# EAGLE design Transient tester (DC supply) r2B1 (EAGLE 6.1)
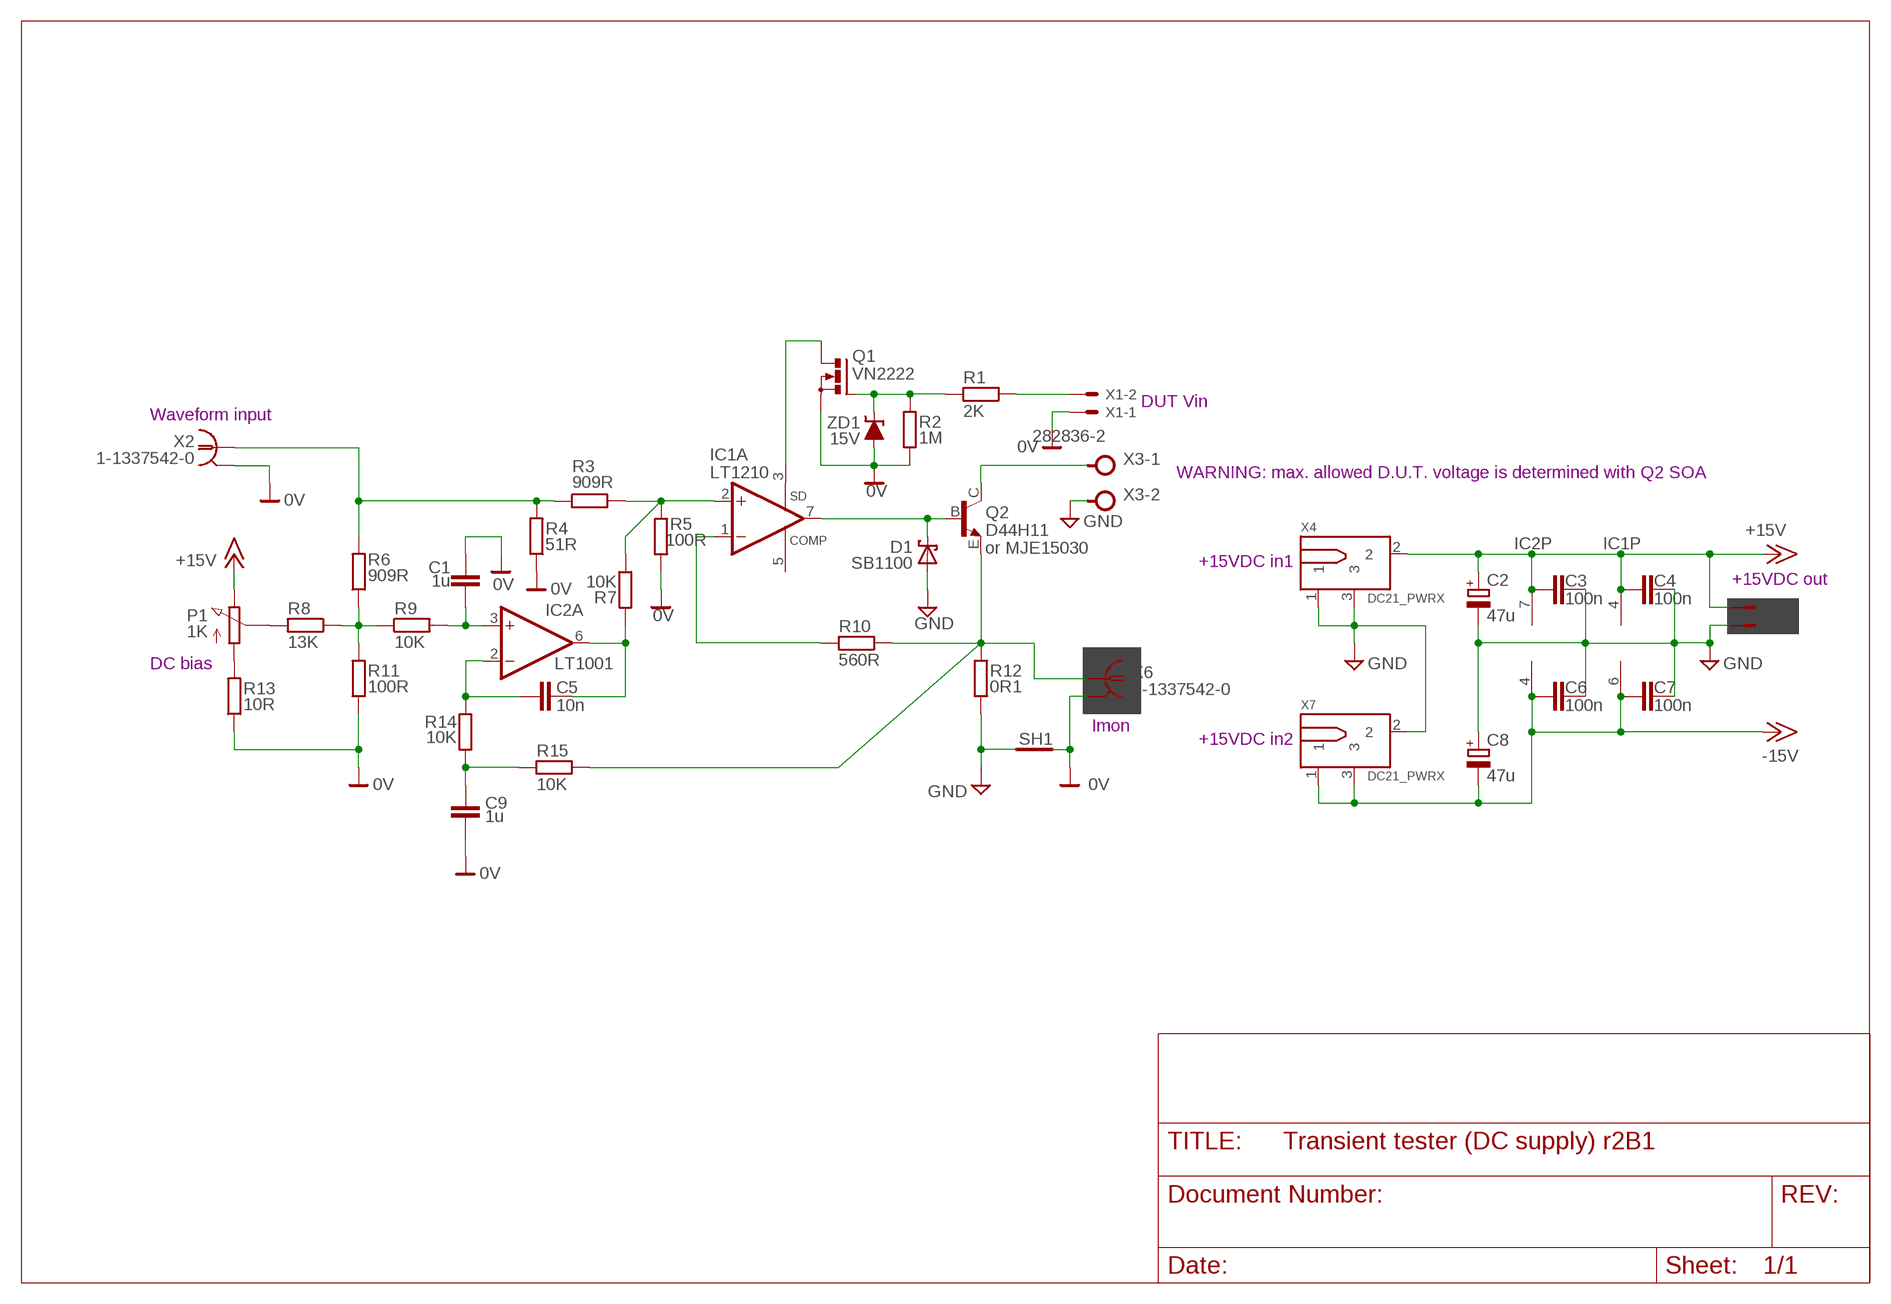
[diagram p0: schematic, sheet 1]

## Parts
C1  1u  C-EU050-075X075  [C050-075X075]
C2  47u  ECAP2.5G_7MM  [ECAP2.5/7]
C3  100n  C-EU050-025X075  [C050-025X075]
C4  100n  C-EU050-025X075  [C050-025X075]
C5  10n  C-EU050-025X075  [C050-025X075]
C6  100n  C-EU050-025X075  [C050-025X075]
C7  100n  C-EU050-025X075  [C050-025X075]
C8  47u  ECAP2.5G_7MM  [ECAP2.5/7]
C9  1u  C-EU050-075X075  [C050-075X075]
D1  SB1100  SCHOTTKY  [DO34/10]
IC1  LT1210  [TO220-7]
IC2  LT1001  [DIL08D]
P1  1K  POTENTIOMETER  [BOURNS_POT91]
Q1  VN2222  2N7000  [TO92-SGD]
Q2  D44H11  [TO220BV]
R1  2K  R-EU_0204/5  [0204/5]
R2  1M  R-EU_0204/5  [0204/5]
R3  909R  R-EU_0207/10  [0207/10]
R4  51R  R-EU_0204/5  [0204/5]
R5  100R  R-EU_0204/5  [0204/5]
R6  909R  R-EU_0207/10  [0207/10]
R7  10K  R-EU_0204/5  [0204/5]
R8  13K  R-EU_0204/5  [0204/5]
R9  10K  R-EU_0204/5  [0204/5]
R10  560R  R-EU_0204/5  [0204/5]
R11  100R  R-EU_0204/5  [0204/5]
R12  0R1  R_EU_OAR1+2512  [OAR1+2512]
R13  10R  R-EU_0204/5  [0204/5]
R14  10K  R-EU_0204/5  [0204/5]
R15  10K  R-EU_0204/5  [0204/5]
SH1  SHORTH  [SHORT_2]
X1  22-23-2021  [22-23-2021]
X2  1-1337542-0  1-227161-0  [AMP_227161]
X3  282836-2  TBLOCK5.0_2A  [TBLOCK5.0_2]
X4  DC21_PWRX  [DC-21MM]
X5  22-23-2021  [22-23-2021]
X6  1-1337542-0  1-227161-0  [AMP_227161]
X7  DC21_PWRX  [DC-21MM]
ZD1  15V  ZENER-DIODE  [DO34-ZD]

## Nets
0V: C1.1 C9.2 Q1.S R2.1 R4.1 R5.2 R11.1 R13.1 SH1.2(GND_B) X1.1 X2.2(GND) X6.2(GND) ZD1.A
+15V: C2.+ C3.2 C4.2 IC1.4(P:V+) IC2.7(P:V+) P1.1(E) X4.2 X5.1
-15V: C6.2 C7.2 C8.- IC1.6(P:V-) IC2.4(P:V-) X7.1 X7.3
GND: C2.- C3.1 C4.1 C6.1 C7.1 C8.+ D1.A R12.1 R12.1.1 SH1.1(GND_A) X3.2 X4.1 X4.3 X5.2 X7.2
N$1: IC1.1(A:-IN) R10.2
N$2: Q2.E R10.1 R12.2 R12.2.1 R15.2 X6.1
N$3: IC1.3(A:SD) Q1.D
N$4: Q1.G R1.2 R2.2 ZD1.C
N$5: D1.C IC1.7(A:OUT) Q2.B
N$6: IC1.2(A:+IN) R3.2 R5.1 R7.1
N$7: C5.1 IC2.6(A:OUT) R7.2
N$8: C5.2 IC2.2(A:-IN) R14.1
N$9: C9.1 R14.2 R15.1
N$10: P1.2(S) R8.2
N$11: P1.3(A) R13.2
N$12: R6.1 R8.1 R9.1 R11.2
N$13: C1.2 IC2.3(A:+IN) R9.2
N$14: R3.1 R4.2 R6.2 X2.1
N$16: Q2.C X3.1
N$24: R1.1 X1.2
Unconnected: IC1.5(A:COMP) IC2.1(O:TRIM) IC2.8(O:TRIM2)

## Notes on the sheet
- DUT Vin
- Waveform input
- WARNING: max. allowed D.U.T. voltage is determined with Q2 SOA
- or MJE15030
- +15VDC in1
- +15VDC out
- DC bias
- Imon
- +15VDC in2

## Library data of the parts
C1 C3-C7 C9 = rcl:C-EU: CAPACITOR, European symbol
C2 C8 = EEZ_Lib1:ECAP
D1 = MyLib6:SCHOTTKY
IC1 = MyLib6:LT1210: 1.1A, 35MHz Current Feedback Amplifier
IC2 = MyLib6:LT1001: Precision Operational Amplifier
P1 = MyLib6:POTENTIOMETER
Q1 = MyLib6:2N7000
Q2 = MyLib6:D44H11: High Power Bipolar Transistor
R1-R11 R13-R15 = rcl:R-EU_: RESISTOR, European symbol
R12 = MyLib6:R_EU: RESISTOR - European symbol
SH1 = MyLib6:SHORT
X1 X5 = con-molex:22-23-2021: .100" (2.54mm) Center Header - 2 Pin; MF: MOLEX; MPN: 22-23-2021; OC_FARNELL: 1462926; OC_NEWARK: 25C3832
X2 X6 = MyLib6:?227161*: JACK, RIGHT ANGLE, 50 OHM, PCB, BNC Source: amp_227161.pdf; MF: TYCO ELECTRONICS; MPN: 1-227161; OC_FARNELL: unknown; OC_NEWARK: 33B3200
X3 = MyLib6:TBLOCK5.0_2A
X4 X7 = EEZ_Lib1:DC21_PWR
ZD1 = MyLib6:ZENER-DIODE

## Net classes
0 default: width 0.254 mm, drill 0.584 mm, clearance 0.254 mm

## Board
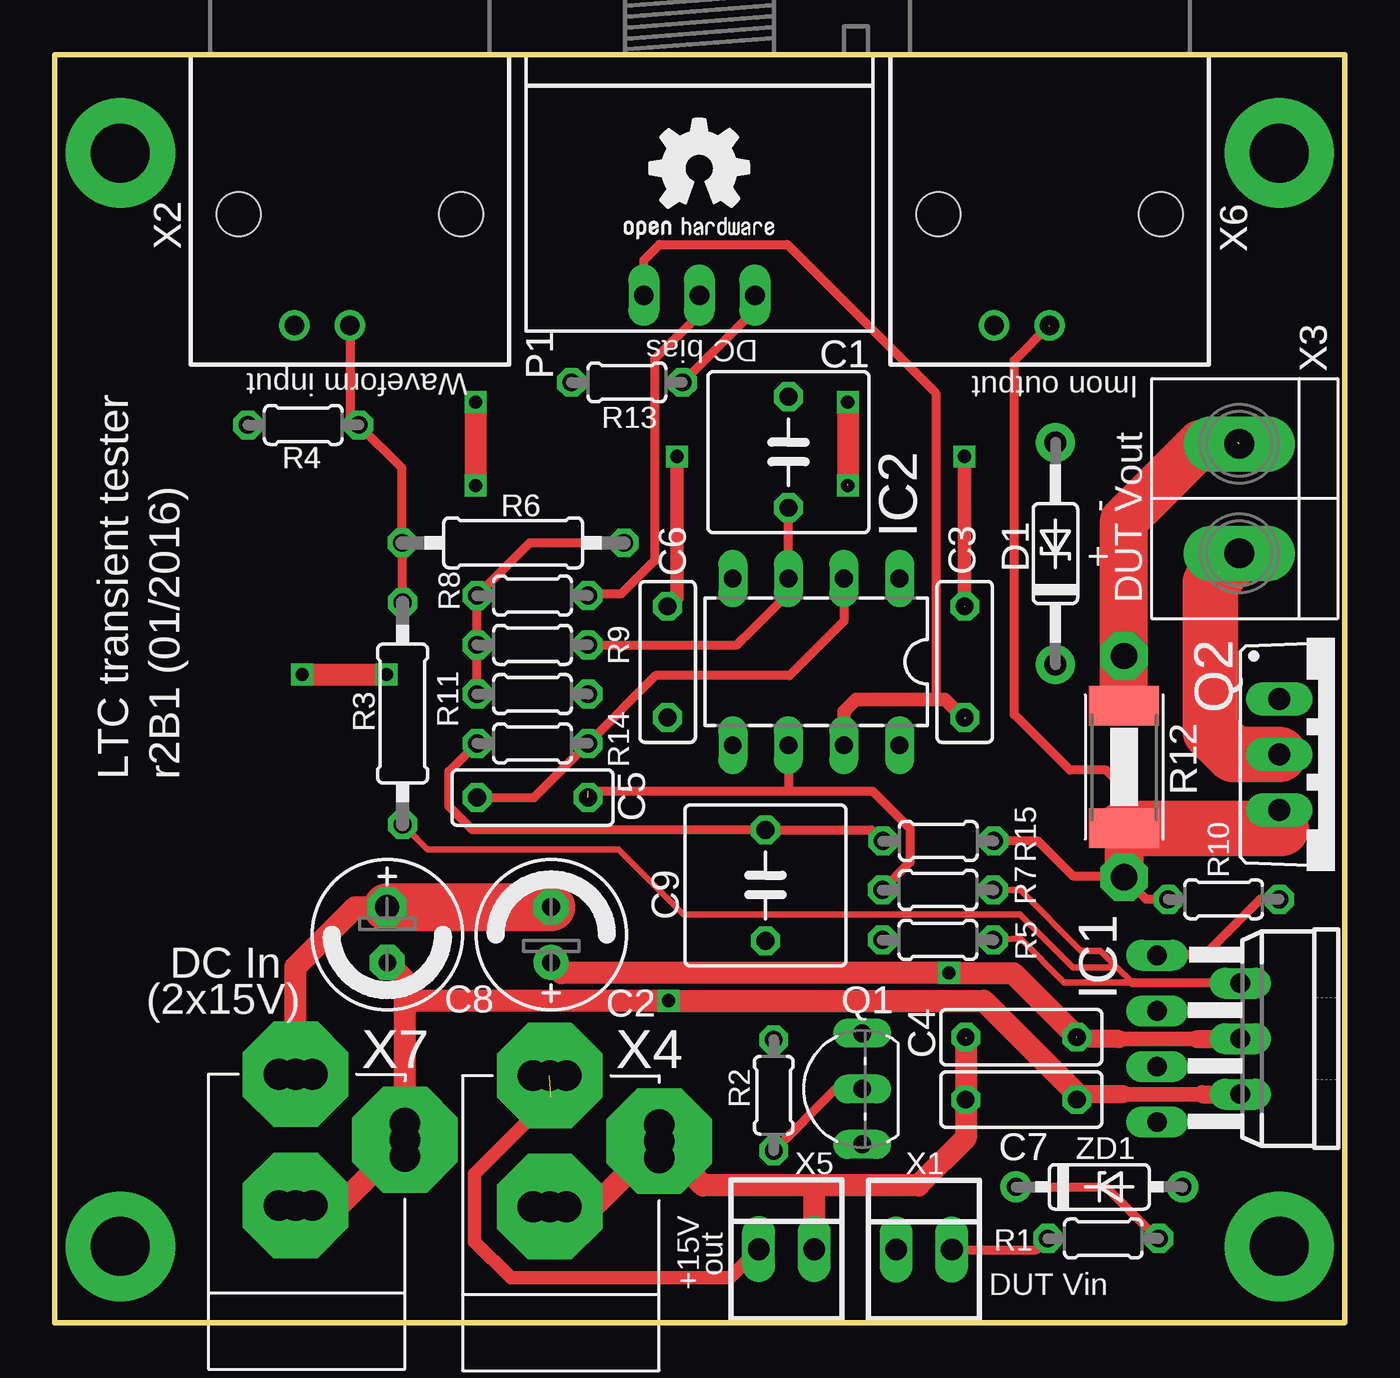
[diagram p1: board, top side]
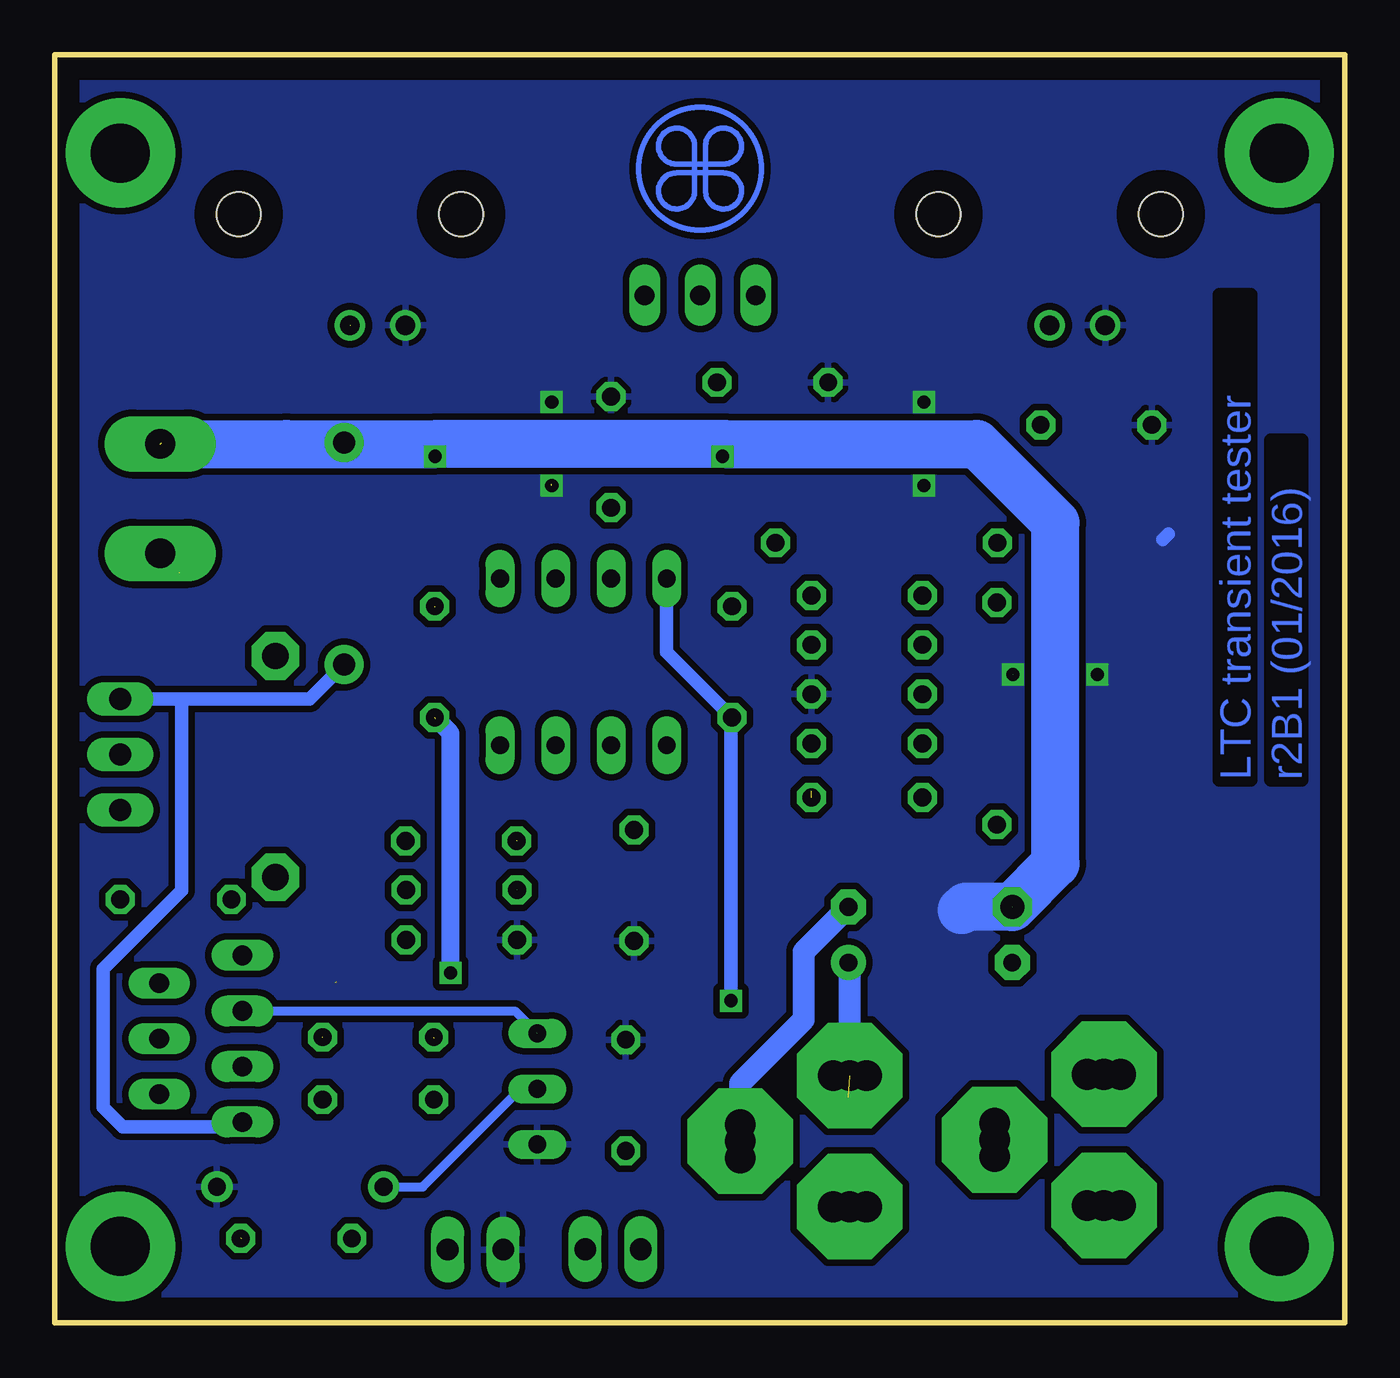
[diagram p2: board, bottom side, seen from below]

Size 59 x 58 mm. Coordinates in mm from the lower left corner, seen from the top.
Outline: 0,58 0,0 59,0 59,58 0,58
Copper layers (1*16): Top 0.035mm / dielectric 1.5mm / Bottom 0.035mm
Design rules: minimum track width 10mil, minimum drill 23mil, track to track 10mil, track to pad 10mil, pad to pad 10mil, via to via 10mil, smd to smd 10mil, copper to edge 40mil, drill to drill 8mil, minimum pad ring 10mil, minimum via ring 8mil, stop-mask expansion 4mil, vias tented up to drill 25mil, thermal gap 10mil

### Footprints (pad centres in the part's own frame; a part is rotated, then mirrored left to right if it is on the bottom)
C050-075X075 = drill 0.813 octagon: 1 -2.54,0; 2 2.54,0
ECAP2.5/7 = drill 0.813 pad 1.6: + -1.27,0 | drill 0.813 pad 1.6 octagon: - 1.27,0
C050-025X075 = drill 0.813 octagon: 1 -2.54,0; 2 2.54,0
DO34/10 = drill 1 pad 1.778: A 5.08,0; C -5.08,0
TO220-7 = drill 0.9 long: 1 -3.81,-4.59; 2 -2.54,-0.78; 3 -1.27,-4.59; 4 0,-0.78; 5 1.27,-4.59; 6 2.54,-0.78; 7 3.81,-4.59
DIL08D = drill 0.813 long: 1 -3.81,-3.81; 2 -1.27,-3.81; 3 1.27,-3.81; 4 3.81,-3.81; 5 3.81,3.81; 6 1.27,3.81; 7 -1.27,3.81; 8 -3.81,3.81
BOURNS_POT91 = drill 0.9 long: 1 2.54,11.049; 2 0,11.049; 3 -2.54,11.049
TO92-SGD = drill 0.813 long: D -2.54,0; G 0,0; S 2.54,0
TO220BV = drill 1.016 long: B -2.54,0; C 0,0; E 2.54,0
0204/5 = drill 0.813 octagon: 1 -2.54,0; 2 2.54,0
0207/10 = drill 0.813 octagon: 1 -5.08,0; 2 5.08,0
OAR1+2512 = smd 1.8 x 3.2: 1 -2.8,0; 2 2.8,0 | drill 1.2 pad 2.184 octagon: 1.1 -5.08,0; 2.1 5.04,0
SHORT_2 = drill 1.1 pad 1.778 octagon: 1 0,0; 2 0,0
22-23-2021 = drill 1 long: 1 -1.27,0; 2 1.27,0
AMP_227161 = drill 0.9 pad 1.27: 1 0,-5.08; 2 -2.54,-5.08 | hole 2: -5.08,0; 5.08,0
TBLOCK5.0_2 = drill 1.35 pad 2.54 long: 1 0,0; 2 0,-5
DC-21MM = drill 1.4 pad 4.826 octagon: 1 -5.08,-3.353; 2 -0.076,-6.35; 3 -0.076,-0.356 | drill 1.4: 4 -5.08,-4.115; 5 -5.08,-2.591; 6 -0.838,-0.356; 7 0.686,-0.356; 8 -0.838,-6.35; 9 0.686,-6.35
DO34-ZD = drill 0.813 pad 1.422: A 3.81,0; C -3.81,0

### Placement (x,y rotation side)
C1  33.55,39.82 270 top
C2  22.71,17.75 90 top
C3  41.62,30.23 270 top
C4  44.2,13.07 0 top
C5  21.85,24.03 180 top
C6  28.03,30.23 270 top
C7  44.2,10.21 0 top
C8  15.21,17.75 270 top
C9  32.5,20.01 270 top
D1  45.76,35.19 90 top
EEZ_SIGNATURE1  SIGNATURESMALL  [SIGNATURE_5MM]  29.49,52.79 180 top
GOLD_ORB_SM  OSHWLOGO_GOLD_ORB_SM  [OSHW2]  25.66,48.52 0 top
IC1  55,13 270 top
IC2  34.82,30.23 180 top
P1  29.48,58.05 180 top
Q1  36.93,10.7 270 top
Q2  56,26 270 top
R1  47.95,3.86 0 top
R2  32.88,10.41 270 top
R3  15.91,27.87 270 top
R4  11.37,41.07 0 top
R5  40.39,17.52 180 top
R6  20.96,35.68 180 top
R7  40.39,19.8 180 top
R8  21.85,33.26 0 top
R9  21.85,31.01 0 top
R10  53.46,19.37 0 top
R11  21.85,28.75 180 top
R12  48.9,25.42 270 top
R13  26.17,43.01 0 top
R14  21.85,26.5 180 top
R15  40.41,22.04 0 top
SH1  15.21,19.03 90 top
X1  39.75,3.36 0 top
X2  13.5,50.7 0 top
X3  54.17,35.2 180 top
X4  22.56,4.96 180 top
X5  33.47,3.37 0 top
X6  45.5,50.7 0 top
X7  10.94,5.02 180 top
ZD1  47.77,6.22 0 top

### Tracks (layer width: path | path; a pad name or v marks a point on that pad's centre or on a via)
0V  (via drill 0.6)  (2 unrouted)
  Top 1.016: 36.27,41.98 36.27,38.36 | v19.25,42.11 v19.25,38.3 | 11.36,29.66 v15.17,29.66
  Bottom 0.61: 8.07,36.08 8.33,35.82
  Bottom 2.184: SH1.2 17.35,19.03 17.51,18.87
  other vias: 36.27,42.11 36.27,38.3 11.31,29.66
  pour Bottom (isolate 0.305): -0.18,58.81 59.51,58.49 59.51,0.07 -0.18,0.39
+15V  (via drill 0.6)  (3 unrouted)
  Top 0.406: P1.1 26.95,48.6 27.66,49.31 33.5,49.31 40.3,42.52 40.3,28.64 40.17,28.52
  Top 0.61: IC2.7 36.09,27.96 36.65,28.52 40.17,28.52 40.71,28.52 41.6,27.63 | 22.71,10.32 19.21,6.83 19.21,3.72 20.86,2.07 30.89,2.07 X5.1
  Top 0.66: 52.24,12.99 48.69,12.99
  Top 0.813: 52.24,12.99 54.21,12.99 IC1.4 | 48.69,12.99 46.83,12.99 C4.2
  Top 1.016: 46.74,13.09 43.82,16.01 v40.9,16.01 23.18,16.01 C2.+ | 46.79,13.02 C4.2
  Bottom 0.813: v40.9,16.01 40.9,26.98 C3.2
  Bottom 1.016: X4.2 22.64,16.41 C2.+
-15V  (via drill 0.6)
  Top 0.66: 52.47,10.46 48.85,10.46
  Top 0.813: 52.47,10.46 IC1.6 | 48.85,10.46 46.99,10.46 C7.2
  Top 1.016: C7.2 46.74,10.48 42.49,14.74 v28.07,14.74 16.06,14.74 16.02,14.7 | X7.3 13.03,5.38 X7.1 16.02,14.7 | 16.02,14.7 16.02,15.67 C8.-
  Bottom 0.61: IC2.4 31.01,30.68 C6.2 28.07,27.65 v28.07,14.74
GND  (via drill 0.6)  (4 unrouted)
  Top 0.406: C7.1 41.66,13.02
  Top 0.61: v41.6,39.63 41.6,32.77 | C6.1 28.07,32.77 28.46,33.15 v28.46,39.63
  Top 1.016: 41.66,13.02 41.66,8.45 39.51,6.29 34.64,6.29 | X7.2 11.02,16.29 13.75,19.02 C8.+ | X4.3 24.64,5.31 X4.1 29.66,6.29 34.64,6.29 | X5.2 34.74,6.2 34.64,6.29
  Top 1.27: R12.1 48.9,28.52
  Top 2.184: 48.9,28.52 R12.1.1 48.9,36.7 52.4,40.2 X3.2 | C8.+ C2.-
  Bottom 0.305: D1.A 48.32,40.27 48.4,40.2 | v41.6,39.63 41.6,40.13
  Bottom 0.406: v28.46,39.63 28.46,40.1 28.36,40.2
  Bottom 0.61: 41.6,40.13 41.54,40.2 | v28.46,39.63 28.46,40.13
  Bottom 1.016: X4.1 27.64,10.97 24.74,13.88 24.74,16.99 C2.-
  Bottom 2.184: X3.2 48.4,40.2 41.54,40.2 28.36,40.2 16.83,40.2 13.23,36.6 13.23,21 C8.+ | 52.78,40.2 54.05,40.2 54.11,40.27
HOLE1  (via drill 2.7 pad 5)
  other vias: 3,53.5
HOLE2  (via drill 2.7 pad 5)
  other vias: 56,53.5
HOLE3  (via drill 2.7 pad 5)
  other vias: 3,3.5
HOLE4  (via drill 2.7 pad 5)
  other vias: 56,3.5
N$1
  Top 0.406: R10.2 55.13,19.37 52.59,16.83 50.86,16.83 IC1.1
N$2  (1 unrouted)
  Top 0.305: 56.09,22.62 56.09,23.37 Q2.E
  Top 0.406: R12.2 48.9,24.45 48.08,25.28 46.43,25.28 43.89,27.82 43.89,44.01 45.47,45.6 | R10.1 49.91,19.37 R12.2.1 48.83,20.45 46.55,20.45 44.97,22.04 R15.2
  Top 1.778: R12.2 R12.2.1
  Top 2.54: R12.2 56.09,22.62
N$3  (1 unrouted)
  Bottom 0.406: IC1.3 37.96,14.27 Q1.D
N$4  (1 unrouted)
  Top 0.406: ZD1.C 48.08,6.22 50.46,3.85 | Q1.G 35.71,10.7 R2.2
  Bottom 0.406: ZD1.C 42.17,6.22 37.69,10.7 Q1.G
N$5
  Bottom 0.61: Q2.B 54.24,28.54 53.25,28.54 | 53.25,28.54 47.34,28.54 D1.C | 50.43,8.96 55.89,8.96 56.78,9.85 56.78,16.19 53.19,19.78 53.19,28.47 53.25,28.54
  Bottom 0.711: IC1.7 50.41,8.98 50.43,8.96
N$6  (1 unrouted)
  Top 0.305: 46.17,15.56 49.28,15.56 48.59,16.26 | 48.59,16.26 46.55,16.26 44.14,18.68 28.76,18.68 25.78,21.65 17.04,21.65 R3.2 | 48.59,16.26 47.82,17.02 46.93,17.02 44.16,19.8 R7.1 | R5.1 44.15,17.58 46.14,15.59
  Top 0.406: 49.28,15.56 54.65,15.56 IC1.2
N$7  (2 unrouted)
  Top 0.406: 24.39,24.33 33.53,24.33 | 33.53,24.33 37.4,24.33 39.12,22.61 39.12,21.08 37.85,19.81 | IC2.6 33.55,24.35 33.53,24.33
N$8
  Top 0.406: IC2.2 36.09,32.09 33.6,29.6 27.49,29.6 R14.1 21.92,24.03 C5.2
N$9  (1 unrouted)
  Top 0.406: 37.85,22.04 37.33,22.55 C9.1 19.11,22.55 18.03,23.62 18.03,25.23 R14.2
N$10
  Top 0.406: P1.2 29.48,46.12 27.43,44.07 27.43,34.86 25.91,33.34 24.47,33.34 R8.2
N$11
  Top 0.406: P1.3 32.02,46.33 R13.2
N$12
  Top 0.406: R11.2 R9.1 R8.1 21.73,35.68 R6.1
N$13
  Top 0.406: C1.2 IC2.3 33.55,33.36 31.72,31.53 31.39,31.2 31.2,31.01 R9.2
N$14
  Top 0.406: X2.1 13.5,41.48 R4.2 15.88,39.09 R6.2 15.91,35.65 R3.1
N$16  (1 unrouted)
  Top 2.54: Q2.C 53.9,26 52.84,27.06 52.84,33.85 53.28,34.3 | 53.28,34.31 X3.1
N$24
  Top 0.406: X1.2 44.9,3.36 R1.1

### Text on the board
Bottom: r2B1 (01/2016) | LTC transient tester
tPlace: DC bias | Waveform input | Imon output | + - | DUT Vout | LTC transient tester | r2B1 (01/2016) | DC In | (2x15V) | +15V | out | DUT Vin
_tNames: X2 | X6 | P1 | C1 | X3 | R13 | R4 | R6 | IC2 | C6 | C3 | D1 | R8 | R9 | Q2 | R3 | R11 | R12 | R14 | C5 | C9 | R15 | R10 | R7 | R5 | C2 | IC1 | C8 | Q1 | X7 | X4 | C4 | R2 | X5 | X1 | C7 | ZD1 | R1